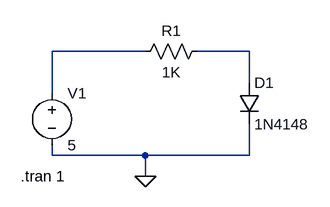
[diagram p0: schematic DiodeVoltageDropTest.asc]
DiodeVoltageDropTest.asc, the LTspice schematic file:
Version 4
SHEET 1 880 680
WIRE 144 80 0 80
WIRE 304 80 224 80
WIRE 304 128 304 80
WIRE 0 144 0 80
WIRE 0 240 0 224
WIRE 144 240 0 240
WIRE 304 240 304 192
WIRE 304 240 144 240
WIRE 144 272 144 240
FLAG 144 272 0
SYMBOL voltage 0 128 R0
SYMATTR InstName V1
SYMATTR Value 5
SYMBOL res 240 64 R90
WINDOW 0 0 56 VBottom 2
WINDOW 3 32 56 VTop 2
SYMATTR InstName R1
SYMATTR Value 1K
SYMBOL diode 288 128 R0
SYMATTR InstName D1
SYMATTR Value 1N4148
TEXT -48 272 Left 2 !.tran 1

The netlist it stands for:
* DiodeVoltageDropTest.asc
V1 N001 0 5
R1 N002 N001 1K
D1 N002 0 1N4148
.model D D
.lib standard.dio
.tran 1
.backanno
.end